# Altium schematic sheet Config_Clock.SchDoc: Configuration Clock
size A; Organization: UCLA High Energy Physics; DocumentNumber: 16; Revision: 2.0; SheetNumber: 16; SheetTotal: 23; CurrentDate: 9/6/2018; ModifiedDate: 9/6/2018
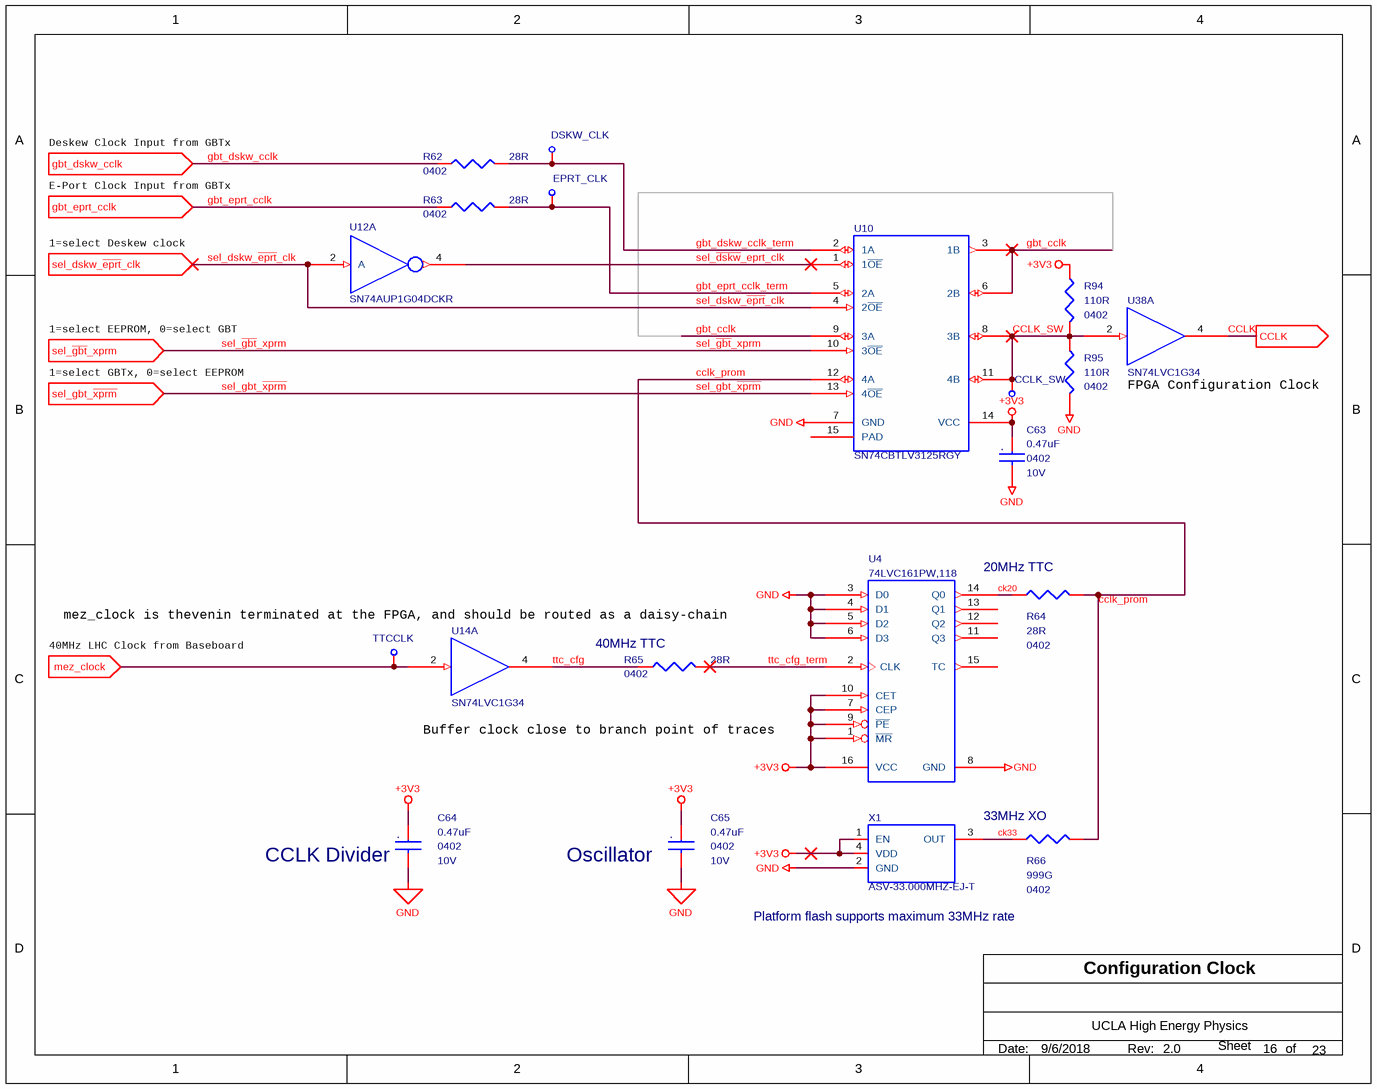
[diagram p0: Config_Clock.SchDoc]

## Parts
C63  0.47uF  Voltage - Rated: 10V  package: 0402  [MC_S6/SM/C_0402_IPC]
C64  0.47uF  package: 0402  Voltage - Rated: 10V  [MC_S6/SM/C_0402_IPC]
C65  0.47uF  package: 0402  Voltage - Rated: 10V  [MC_S6/SM/C_0402_IPC]
CCLK_SW  Test Point Via  [MC_S6/TH/TPVIA]  (value not drawn)  (no BOM)
DSKW_CLK  Test Point Via  [MC_S6/TH/TPVIA]  (value not drawn)  (no BOM)
EPRT_CLK  Test Point Via  [MC_S6/TH/TPVIA]  (value not drawn)  (no BOM)
R62  28R  Supplier Device Package: 0402  [MC_S6/SM/R_0402_IPC]
R63  28R  Supplier Device Package: 0402  [MC_S6/SM/R_0402_IPC]
R64  28R  Supplier Device Package: 0402  [MC_S6/SM/R_0402_IPC]
R65  28R  Supplier Device Package: 0402  [MC_S6/SM/R_0402_IPC]
R66  999G  Supplier Device Package: 0402  [MC_S6/SM/R_0402_IPC]  (no BOM)
R94  110R  Supplier Device Package: 0402  [MC_S6/SM/R_0402_IPC]
R95  110R  Supplier Device Package: 0402  [MC_S6/SM/R_0402_IPC]
TTCCLK  Test Point Via  [MC_S6/TH/TPVIA]  (value not drawn)  (no BOM)
U4  74LVC161PW,118  [MC_S6/SM/TSSOP16]
U10  SN74CBTLV3125RGY  [S-PVQFN-N14]
U12  SN74AUP1G04DCKR  [MC_S6/SM/SOT_SC70_DCK5]  (part A of 2)
U14  SN74LVC1G34  [MC_S6/SM/SOT_553_DRL5]  (part A of 2)
U38  SN74LVC1G34  [MC_S6/SM/SOT_553_DRL5]  (part A of 2)
X1  ASV-33.000MHZ-EJ-T  [MC_S6/SM/XTAL-7x5.08]

## Ports
CCLK (out), gbt_dskw_cclk (in), gbt_eprt_cclk (in), mez_clock (in), sel_dskw_~{eprt}_clk (in), sel_gbt_~{xprm} (in), sel_~{gbt}_xprm (in)

## Nets
+3V3: C63.1 C64.1 C65.1 R94.1 U4.1(~{MR}) U4.7(CEP) U4.9(~{PE}) U4.10(CET) U4.16(VCC) U10.14(VCC) X1.1(EN) X1.4(VDD)
GND: C63.2 C64.2 C65.2 R95.2 U4.3(D0) U4.4(D1) U4.5(D2) U4.6(D3) U4.8(GND) U10.7(GND) X1.2(GND)
CCLK: U38.4(Y) ; port CCLK
cclk_prom: R64.2 R66.2 U10.12(4A)
CCLK_SW: CCLK_SW.1(In) R94.2 R95.1 U10.8(3B) U10.11(4B) U38.2(A)
ck20: R64.1 U4.14(Q0)
ck33: R66.1 X1.3(OUT)
gbt_cclk: U10.3(1B) U10.6(2B) U10.9(3A)
gbt_dskw_cclk: R62.1 ; port gbt_dskw_cclk
gbt_dskw_cclk_term: DSKW_CLK.1(In) R62.2 U10.2(1A)
gbt_eprt_cclk: R63.1 ; port gbt_eprt_cclk
gbt_eprt_cclk_term: EPRT_CLK.1(In) R63.2 U10.5(2A)
mez_clock: TTCCLK.1(In) U14.2(A) ; port mez_clock
sel_~{dskw}_eprt_clk: U10.1(1~{OE}) U12.4(Y)
sel_dskw_~{eprt}_clk: U10.4(2~{OE}) U12.2(A) ; port sel_dskw_~{eprt}_clk
sel_~{gbt}_xprm: U10.10(3~{OE}) ; port sel_~{gbt}_xprm
sel_gbt_~{xprm}: U10.13(4~{OE}) ; port sel_gbt_~{xprm}
ttc_cfg: R65.1 U14.4(Y)
ttc_cfg_term: R65.2 U4.2(CLK)

Not connected (* = marked no-connect by the designer): U4 11(Q3) 12(Q2) 13(Q1) 15(TC); U10 15(PAD)

## Notes on the sheet
- Deskew Clock Input from GBTx
- E-Port Clock Input from GBTx
- 1=select Deskew clock
- 1=select GBTx, 0=select EEPROM
- 1=select EEPROM, 0=select GBT
- FPGA Configuration Clock
- (near R64) 20MHz TTC
- 40MHz LHC Clock from Baseboard
- mez_clock is thevenin terminated at the FPGA, and should be routed as a daisy-chain
- (near R65) 40MHz TTC
- Buffer clock close to branch point of traces
- (near R66) 33MHz XO
- (near C64) CCLK Divider
- (near C65) Oscillator
- (near X1) Platform flash supports maximum 33MHz rate
- Date:
- Rev:
- of
- Sheet
- (in symbol GRM155R61A474KE15D) .

## Library data of the parts
C63-C65 = GRM155R61A474KE15D: CAP CER 0.47UF 10V X5R 0402; Manufacturer: Murata Electronics North America; Capacitance: 0.47µF; Tolerance: ±10%; Supplier 1: Digi-Key; Manufacturer Part Number: GRM155R61A474KE15D; RoHS: RoHS Compliant; Category: Capacitors; Stock 1: 506743; Pricing 1: 1=0.1, 10=0.064, 50=0.0344, 100=0.0292, 250=0.02384, 500=0.0204, 1000=0.0159, 5000=0.01325 (USD); Packaging: Cut Tape (CT); Part Status: Active; Operating Temperature: -55°C ~ 85°C; Features: -; Ratings: -; Applications: General Purpose; Mounting Type: Surface Mount, MLCC; Package / Case: 0402 (1005 Metric); Size / Dimension: 0.039" L x 0.020" W (1.00mm x 0.50mm); Height - Seated (Max): -; Thickness (Max): 0.022" (0.55mm); Lead Spacing: -; Lead Style: -; ComponentLink1URL: http://www.murata.com/~/media/webrenewal/support/library/catalog/products/capacitor/mlcc/c02e.pdf; ComponentLink1Description: http://www.murata.com/~/media/webrenewal/support/library/catalog/products/capacitor/mlcc/c02e.pdf; Supplier 2: Digi-Key; Stock 2: 506743; Pricing 2: 1=0.1, 10=0.064, 50=0.0344, 100=0.0292, 250=0.02384, 500=0.0204, 1000=0.0159, 5000=0.01325 (USD); Supplier Part Number 1: 490-3264-1-ND; Supplier Part Number 2: 490-3264-6-ND; Temperature Coefficient: X5R
CCLK_SW DSKW_CLK EPRT_CLK TTCCLK = TPVIA: COMPSIDE: TOP; COMPGROUP: 0; mfgr: Layout; COMPROT: 0; Package: 90; mfgr_id: TPVIA; mfgr_foot: TPVIA
R62-R65 = ERJ-2RKF28R0X: RES SMD 28 OHM 1% 1/10W 0402; Manufacturer: Panasonic Electronic Components; Power (Watts): 0.1W, 1/10W; Temperature Coefficient: ±100ppm/°C; Tolerance: ±1%; Supplier 1: Digi-Key; Manufacturer Part Number: ERJ-2RKF28R0X; RoHS: RoHS Compliant; Category: Resistors; Stock 1: 85659; Pricing 1: 1=0.1, 10=0.023, 100=0.0093, 1000=0.00419, 2500=0.00364, 5000=0.00301 (USD); Packaging: Cut Tape (CT); Part Status: Active; Composition: Thick Film; Features: Automotive AEC-Q200; Operating Temperature: -55°C ~ 155°C; Package / Case: 0402 (1005 Metric); Size / Dimension: 0.039" L x 0.020" W (1.00mm x 0.50mm); Height - Seated (Max): 0.016" (0.40mm); Failure Rate: -; ComponentLink1URL: https://industrial.panasonic.com/cdbs/www-data/pdf/RDA0000/AOA0000C304.pdf; ComponentLink1Description: https://industrial.panasonic.com/cdbs/www-data/pdf/RDA0000/AOA0000C304.pdf; Supplier 2: Digi-Key; Stock 2: 85659; Pricing 2: 1=0.1, 10=0.023, 100=0.0093, 1000=0.00419, 2500=0.00364, 5000=0.00301 (USD); Supplier Part Number 1: P28.0LCT-ND; Supplier Part Number 2: P28.0LDKR-ND
R66 = RES999G 0402: RES SMD 999G OHM 5% 1/16W 0402; Manufacturer Part Number: Do Not Place
R94 R95 = ERJ-2RKF1100X: RES SMD 110 OHM 1% 1/10W 0402; Manufacturer: Panasonic Electronic Components; Power (Watts): 0.1W, 1/10W; Temperature Coefficient: ±100ppm/°C; Supplier 1: Digi-Key; Manufacturer Part Number: ERJ-2RKF1100X; RoHS: RoHS Compliant; Category: Resistors; Stock 1: 171366; Pricing 1: 1=0.1, 10=0.039, 100=0.016, 1000=0.00719, 2500=0.00624, 5000=0.00515 (USD); Packaging: Cut Tape (CT); Part Status: Active; Tolerance: ±1%; Composition: Thick Film; Features: Automotive AEC-Q200; Operating Temperature: -55°C ~ 155°C; Package / Case: 0402 (1005 Metric); Size / Dimension: 0.039" L x 0.020" W (1.00mm x 0.50mm); Height - Seated (Max): 0.016" (0.40mm); Failure Rate: -; ComponentLink1URL: https://industrial.panasonic.com/cdbs/www-data/pdf/RDA0000/AOA0000C304.pdf; ComponentLink1Description: https://industrial.panasonic.com/cdbs/www-data/pdf/RDA0000/AOA0000C304.pdf; Supplier 2: Digi-Key; Stock 2: 171366; Pricing 2: 1=0.1, 10=0.039, 100=0.016, 1000=0.00719, 2500=0.00624, 5000=0.00515 (USD); Supplier Part Number 1: P110LCT-ND; Supplier Part Number 2: P110LDKR-ND
U4 = 74LVC161PW: IC SYNC 4BIT BIN COUNTER 16TSSOP; Manufacturer: NXP USA Inc.; Logic Type: Binary Counter; Direction: Up; Number of Elements: 1; Number of Bits per Element: 4; Reset: Asynchronous; Timing: Synchronous; Count Rate: 150MHz; Trigger Type: Positive Edge; Voltage - Supply: 1.2 V ~ 3.6 V; Supplier 1: Digi-Key; Manufacturer Part Number: 74LVC161PW,118; RoHS: RoHS Compliant; Category: Integrated Circuits (ICs); Stock 1: 3261; Pricing 1: 1=0.64, 10=0.561, 100=0.429, 500=0.3399, 1000=0.27225 (USD); Packaging: Cut Tape (CT); Part Status: Active; Operating Temperature: -40°C ~ 125°C; Mounting Type: Surface Mount; Package / Case: 16-TSSOP (0.173", 4.40mm Width); Supplier Device Package: 16-TSSOP; ComponentLink1URL: http://www.nxp.com/documents/data_sheet/74LVC161.pdf; ComponentLink1Description: http://www.nxp.com/documents/data_sheet/74LVC161.pdf; Supplier 2: Digi-Key; Stock 2: 3261; Pricing 2: 1=0.64, 10=0.561, 100=0.429, 500=0.3399, 1000=0.27225 (USD); Supplier Part Number 1: 568-7667-1-ND; Supplier Part Number 2: 568-7667-6-ND; Supplier 3: Digi-Key; Stock 3: 1164; Pricing 3: 1=0.64, 10=0.561, 100=0.43, 500=0.3399, 1000=0.27192 (USD); ComponentLink2URL: http://assets.nexperia.com/documents/data-sheet/74LVC161.pdf; ComponentLink2Description: http://assets.nexperia.com/documents/data-sheet/74LVC161.pdf; Supplier 4: Digi-Key; Stock 4: 1164; Pricing 4: 1=0.64, 10=0.561, 100=0.43, 500=0.3399, 1000=0.27192 (USD); Supplier Part Number 3: 1727-5981-1-ND; Supplier Part Number 4: 1727-5981-6-ND
U10 = SN74CBTLV3125RGY: IC 4 BIT FET BUS SWITCH, QFN-14; Manufacturer: Texas Instruments; Manufacturer Part Number: SN74CBTLV3125RGYR; Circuit: 1 x 1:1; Voltage - Supply: 2.3 V ~ 3.6 V; Voltage Supply Source: Single Supply; Category: Integrated Circuits (ICs); ComponentLink1Description: http://www.ti.com/lit/ds/symlink/sn74cbtlv3125.pdf; ComponentLink1URL: http://www.ti.com/lit/ds/symlink/sn74cbtlv3125.pdf; Current - Output High, Low: -; Mounting Type: Surface Mount; Operating Temperature: -40°C ~ 85°C; Package / Case: 14-VFQFN Exposed Pad; Packaging: Cut Tape (CT); Part Status: Active; Pricing 1: 1=0.93, 10=0.83, 100=0.6467, 500=0.53426, 1000=0.42179 (USD); Pricing 2: 1=0.93, 10=0.83, 100=0.6467, 500=0.53426, 1000=0.42179 (USD); RoHS: RoHS Compliant; Stock 1: 3196; Stock 2: 3196; Supplier 1: Digi-Key; Supplier 2: Digi-Key; Supplier Device Package: 14-VQFN (3.5x3.5); Supplier Part Number 1: 296-15103-1-ND; Supplier Part Number 2: 296-15103-6-ND; Type: Bus Switch
U12 = SN74AUP1G04DCKR: IC INVERTER LP 5TSSOP; Manufacturer: Texas Instruments; Number of Inputs: 1; Voltage - Supply: 0.8 V ~ 3.6 V; Current - Output High, Low: 4mA, 4mA; Logic Level - Low: 0.7 V ~ 0.9 V; Logic Level - High: 1.6 V ~ 2 V; Max Propagation Delay @ V, Max CL: 5.4ns @ 3.3V, 30pF; Supplier 1: Digi-Key; Manufacturer Part Number: SN74AUP1G04DCKR; RoHS: RoHS Compliant; Category: Integrated Circuits (ICs); Stock 1: 7270; Pricing 1: 1=0.48, 10=0.364, 100=0.227, 500=0.15532, 1000=0.11948 (USD); Packaging: Digi-Reel®; Part Status: Active; Logic Type: Inverter; Features: -; Operating Temperature: -40°C ~ 85°C; Mounting Type: Surface Mount; Supplier Device Package: SC-70-5; Package / Case: 5-TSSOP, SC-70-5, SOT-353; ComponentLink1URL: http://www.ti.com/lit/ds/symlink/sn74aup1g04.pdf; ComponentLink1Description: http://www.ti.com/lit/ds/symlink/sn74aup1g04.pdf; Supplier 2: Digi-Key; Stock 2: 7270; Pricing 2: 1=0.48, 10=0.364, 100=0.227, 500=0.15532, 1000=0.11948 (USD); Supplier Part Number 1: 296-19072-6-ND; Supplier Part Number 2: 296-19072-1-ND
U14 U38 = SN74LVC1G34DRLR: IC BUFFER NON-INVERT SOT5; Manufacturer: Texas Instruments; mfgr: Texas Inst; mfgr_foot: DRL; COMPROT: 270; COMPGROUP: 0; COMPSIDE: TOP; Logic Type: Buffer, Non-Inverting; Number of Bits per Element: 1; Output Type: Push-Pull; Current - Output High, Low: 32mA, 32mA; Voltage - Supply: 1.65 V ~ 5.5 V; Package: 99; mfgr_id: SN74LVC1G34DRLR; Supplier 1: Digi-Key; Manufacturer Part Number: SN74LVC1G34DRLR; RoHS: RoHS Compliant; Category: Integrated Circuits (ICs); Stock 1: 1633; Pricing 1: 1=0.48, 10=0.387, 100=0.2637, 500=0.19776, 1000=0.14832 (USD); Packaging: Cut Tape (CT); Part Status: Active; Input Type: -; Operating Temperature: -40°C ~ 125°C (TA); Mounting Type: Surface Mount; Package / Case: SOT-553; Supplier Device Package: SOT-5; ComponentLink1URL: http://www.ti.com/lit/ds/symlink/sn74lvc1g34.pdf; ComponentLink1Description: http://www.ti.com/lit/ds/symlink/sn74lvc1g34.pdf; Supplier 2: Digi-Key; Stock 2: 1633; Pricing 2: 1=0.48, 10=0.387, 100=0.2637, 500=0.19776, 1000=0.14832 (USD); Supplier Part Number 1: 296-18017-1-ND; Supplier Part Number 2: 296-18017-6-ND
X1 = ASV-33.000MHZ-EJ-T: XTAL, 33MHz, CMOS; Manufacturer: Abracon LLC; Function: Enable/Disable; Output: HCMOS; Voltage - Supply: 3.3V; Frequency Stability: ±20ppm; Current - Supply (Max): 20mA; Current - Supply (Disable) (Max): 10µA; Supplier 1: Digi-Key; Manufacturer Part Number: ASV-33.000MHZ-EJ-T; RoHS: RoHS Compliant; Category: Crystals, Oscillators, Resonators; Stock 1: 9939; Pricing 1: 1=1.73, 10=1.656, 50=1.617, 100=1.386, 500=1.3475 (USD); Packaging: Digi-Reel®; Part Status: Active; Type: XO (Standard); Frequency: 33MHz; Operating Temperature: -20°C ~ 70°C; Ratings: -; Mounting Type: Surface Mount; Size / Dimension: 0.276" L x 0.200" W (7.00mm x 5.08mm); Package / Case: 4-SMD, No Lead; ComponentLink1URL: http://www.abracon.com/Oscillators/ASV.pdf; ComponentLink1Description: http://www.abracon.com/Oscillators/ASV.pdf; Supplier Part Number 1: 535-9324-6-ND; Height - Seated (Max): 0.071" (1.80mm)